# Altium schematic sheet Motor Connection.SchDoc: Motor Connection
size A4; DocumentNumber: 12; SheetNumber: 12; SheetTotal: 51
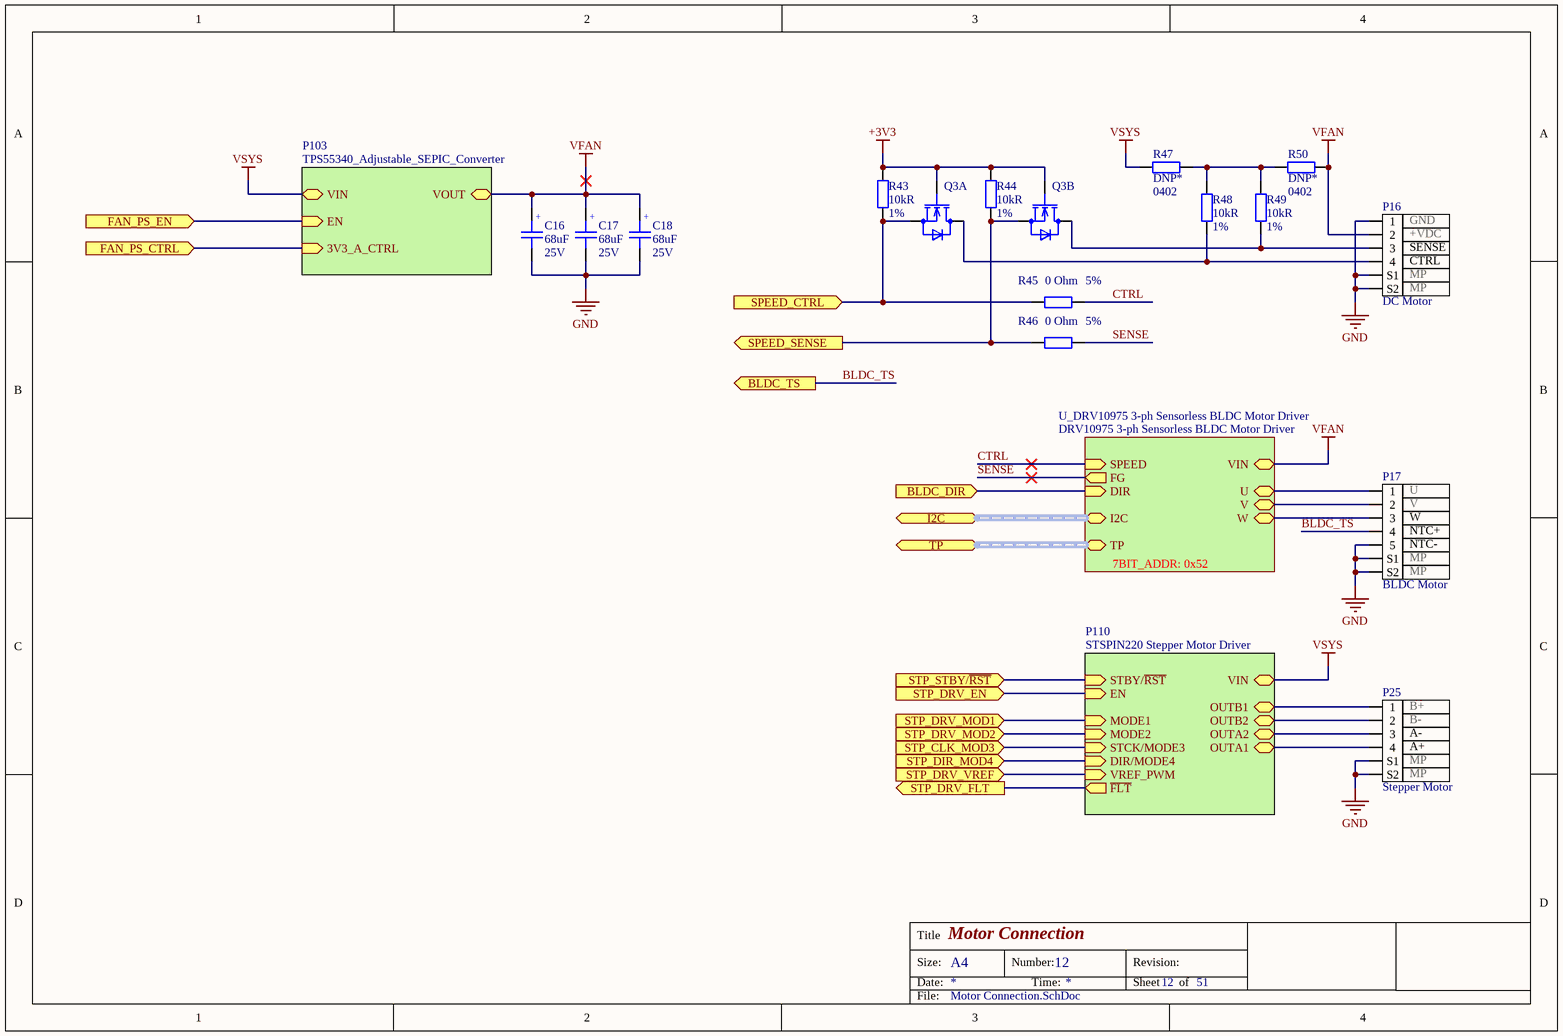
[diagram p0: Motor Connection.SchDoc]

## Parts
C16  Capacitance: 68uF  Rated Voltage: 25V  [WCAP-ASLI_6.3x5.5]  (hidden comment: CAP ALUM 68 UF 20% 25 V SMD)
C17  Capacitance: 68uF  Rated Voltage: 25V  [WCAP-ASLI_6.3x5.5]  (hidden comment: CAP ALUM 68 UF 20% 25 V SMD)
C18  Capacitance: 68uF  Rated Voltage: 25V  [WCAP-ASLI_6.3x5.5]  (hidden comment: CAP ALUM 68 UF 20% 25 V SMD)
P16  DC Motor  pin_1: GND  pin_2: +VDC  pin_MP1: MP  pin_3: SENSE  pin_4: CTRL  [CONN_JST_S4B-ZR-SM4A-TF(LF)(SN)]
P17  BLDC Motor  pin_1: U  pin_2: V  pin_MP1: MP  pin_3: W  pin_4: NTC+  pin_5: NTC-  [CONN_JST_S5B-ZR-SM4A-TF(LF)(SN)]
P25  Stepper Motor  pin_1: B+  pin_2: B-  pin_MP1: MP  pin_3: A-  pin_4: A+  [CONN_JST_SM4B-NSHSS-TB(LF)(SN)]
Q3  DMN32D2LV-7  [SON_400UV-7_DIO]  (value not drawn)  (parts A,B of 2)
R43  Resistance: 10kR  Tolerance: 1%  [R0402]  (hidden comment: RES SMD 10K OHM 1% 1/16W 0402)
R44  Resistance: 10kR  Tolerance: 1%  [R0402]  (hidden comment: RES SMD 10K OHM 1% 1/16W 0402)
R45  Tolerance: 5%  Resistance: 0 Ohm  [R0402]  (hidden comment: RES SMD 0 OHM JUMPER 1/16W 0402)
R46  Tolerance: 5%  Resistance: 0 Ohm  [R0402]  (hidden comment: RES SMD 0 OHM JUMPER 1/16W 0402)
R47  DNP*  Case/Package: 0402  [R0402]  (no BOM)
R48  Resistance: 10kR  Tolerance: 1%  [R0402]  (hidden comment: RES SMD 10K OHM 1% 1/16W 0402)
R49  Resistance: 10kR  Tolerance: 1%  [R0402]  (hidden comment: RES SMD 10K OHM 1% 1/16W 0402)
R50  DNP*  Case/Package: 0402  [R0402]  (no BOM)

## Sub-sheets
P103 = TPS55340_Adjustable_SEPIC_Converter: EN (in), VIN, VOUT, 3V3_A_CTRL (in)
P110 = STSPIN220 Stepper Motor Driver: MODE1 (in), OUTB1, VREF_PWM (in), EN (in), MODE2 (in), OUTB2, OUTA2, DIR/MODE4 (in), STCK/MODE3 (in), ~{FLT} (out), STBY/~{RST} (in), OUTA1, VIN
U_DRV10975 3-ph Sensorless BLDC Motor Driver = DRV10975 3-ph Sensorless BLDC Motor Driver: U, V, W, VIN, SPEED (in), DIR (in), FG (out), I2C (harness I2C), TP (harness DRV10975_TP)  | 7BIT_ADDR: 0x52

## Ports
BLDC_DIR (in), BLDC_TS (out), FAN_PS_CTRL (in), FAN_PS_EN (in), I2C (harness I2C), SPEED_CTRL (in), SPEED_SENSE (out), STP_CLK_MOD3 (in), STP_DIR_MOD4 (in), STP_DRV_EN (in), STP_DRV_FLT (out), STP_DRV_MOD1 (in), STP_DRV_MOD2 (in), STP_DRV_VREF (in), STP_STBY/~{RST} (in), TP (harness DRV10975_TP)

## Nets
+3V3: Q3.2(G) Q3.5(G) R43.1 R44.1
GND: C16.2 C17.2 C18.2 P16.1 P16.S1 P16.S2 P17.5 P17.S1 P17.S2 P25.S1 P25.S2
VFAN: C16.1 C17.1 C18.1 P16.2 R50.2 ; sheet P103/VOUT, sheet U_DRV10975 3-ph Sensorless BLDC Motor Driver/VIN
VSYS: R47.1 ; sheet P110/VIN, sheet P103/VIN
BLDC_DIR: port BLDC_DIR, sheet U_DRV10975 3-ph Sensorless BLDC Motor Driver/DIR
BLDC_TS: P17.4 ; port BLDC_TS
CTRL: R45.2 ; sheet U_DRV10975 3-ph Sensorless BLDC Motor Driver/SPEED
FAN_PS_CTRL: port FAN_PS_CTRL, sheet P103/3V3_A_CTRL
FAN_PS_EN: port FAN_PS_EN, sheet P103/EN
SENSE: R46.2 ; sheet U_DRV10975 3-ph Sensorless BLDC Motor Driver/FG
SPEED_CTRL: Q3.1(S) R43.2 R45.1 ; port SPEED_CTRL
SPEED_SENSE: Q3.4(S) R44.2 R46.1 ; port SPEED_SENSE
STP_CLK_MOD3: port STP_CLK_MOD3, sheet P110/STCK/MODE3
STP_DIR_MOD4: port STP_DIR_MOD4, sheet P110/DIR/MODE4
STP_DRV_EN: port STP_DRV_EN, sheet P110/EN
STP_DRV_FLT: port STP_DRV_FLT, sheet P110/~{FLT}
STP_DRV_MOD1: port STP_DRV_MOD1, sheet P110/MODE1
STP_DRV_MOD2: port STP_DRV_MOD2, sheet P110/MODE2
STP_DRV_VREF: port STP_DRV_VREF, sheet P110/VREF_PWM
STP_STBY/~{RST}: port STP_STBY/~{RST}, sheet P110/STBY/~{RST}
NetP16_3: P16.3 Q3.3(D) R49.2
NetP16_4: P16.4 Q3.6(D) R48.2
NetP17_1: P17.1 ; sheet U_DRV10975 3-ph Sensorless BLDC Motor Driver/U
NetP17_2: P17.2 ; sheet U_DRV10975 3-ph Sensorless BLDC Motor Driver/V
NetP17_3: P17.3 ; sheet U_DRV10975 3-ph Sensorless BLDC Motor Driver/W
NetP25_1: P25.1 ; sheet P110/OUTB1
NetP25_2: P25.2 ; sheet P110/OUTB2
NetP25_3: P25.3 ; sheet P110/OUTA2
NetP25_4: P25.4 ; sheet P110/OUTA1
NetR47_2: R47.2 R48.1 R49.1 R50.1

## Buses and harness runs
harness port I2C = sheet U_DRV10975 3-ph Sensorless BLDC Motor Driver/I2C
harness port TP = sheet U_DRV10975 3-ph Sensorless BLDC Motor Driver/TP

## Notes on the sheet
- Title
- Size:
- Date:
- A4
- Number:
- Time:
- Revision:
- Sheet
- of
- File:
- (in symbol CAP ALUM 68 UF 20% 25 V SMD) +

## Library data of the parts
C16-C18 = CAP ALUM 68 UF 20% 25 V SMD: 68µF 25V Aluminum Electrolytic Capacitors Radial, Can - SMD  2000 Hrs @ 105°C; Manufacturer: Wurth Elektronik; Manufacturer Part Number: 865080443009; Dissipation Factor: 14%; Endurance: 2000h; Leakage Current: 17uA; Ripple Current: 240mA; Capacitance Tolerance: +/-20%; Technical Reference: ASED055680M025DVCTBB000; Supplier 1: Digi-Key; Packaging: Tape and Reel; ComponentLink1URL: http://www.we-online.de; ComponentLink1Description: Manufacturer; Supplier Part Number 1: 732-8437-1-ND; Diameter: 6.3mm; Height: 5.5mm; ComponentLink2URL: https://www.we-online.com/catalog/datasheet/865080443009.pdf; ComponentLink2Description: Datasheet; Mounting Technology: SMT; Operating Temperature: -55 to +105degC; Published Date: May 2020; Mount: Surface Mount
P16 = CONN HEADER SMD R/A 4POS 1.5MM: Connector Header Surface Mount, Right Angle 4 position 0.059" (1.50mm); Manufacturer: JST; Manufacturer Part Number: S4B-ZR-SM4A-TF(LF)(SN); Number of Positions: 4; Connector Type: Male Pin; Contact Resistance: 30mR; Max Current Rating: 1A; Voltage Rating: 50V; Gender: Male; Pitch: 1.5mm; Supplier 1: Digi-Key; Stock 1: 0; Mount: Surface Mount; Color: Natural; Contact Plating: Tin,Copper; Contact Material: Brass,Tin; Housing Color: Beige; Housing Material: Polyamide; Min Operating Temperature: -25°C; Max Operating Temperature: 85°C; Number of Rows: 1; Packaging: Tape and Reel; Series: ZH; Contact Type: Male Pin; Termination: Solder; Current Rating: 1A; Fastening Type: Detent; Max Voltage Rating (AC): 50V; Max Voltage Rating (DC): 50V; Number of Contacts: 4; Orientation: Right Angle; Length: 9mm; Width: 3.5mm; Height: 7.2mm; Depth: 6.5mm; Lead Free: Lead Free; ComponentLink1URL: http://www.jst-mfg.com/product/pdf/eng/eZH.pdf?src-supplier=Digi-Key; ComponentLink1Description: http://www.jst-mfg.com/product/pdf/eng/eZH.pdf?src-supplier=Digi-Key; ComponentLink2URL: http://uk.rs-online.com/webdocs/13ed/0900766b813ed0da.pdf?src-supplier=RSComponents; ComponentLink2Description: http://uk.rs-online.com/webdocs/13ed/0900766b813ed0da.pdf?src-supplier=RSComponents; ComponentLink3URL: https://www.verical.com/server-webapp/html/getDatasheet?partID=646289&src-supplier=Verical; ComponentLink3Description: https://www.verical.com/server-webapp/html/getDatasheet?partID=646289&src-supplier=Verical; ComponentLink4URL: https://www.verical.com/server-webapp/html/getDatasheet?partID=558977&src-supplier=Verical; ComponentLink4Description: https://www.verical.com/server-webapp/html/getDatasheet?partID=558977&src-supplier=Verical; Supplier Part Number 1: 455-1695-1-ND; pin_MP2: MP
P17 = CONN HEADER SMD R/A 5POS 1.5MM: Connector Header Surface Mount, Right Angle 5 position 0.059" (1.50mm); Manufacturer: JST; Manufacturer Part Number: S5B-ZR-SM4A-TF(LF)(SN); Number of Positions: 5; Connector Type: Male Pin; Contact Resistance: 30mR; Current Rating: 1A; Voltage Rating: 50V; Gender: Male; Pitch: 1.5mm; Supplier 1: Digi-Key; Stock 1: 0; Mount: Surface Mount; Color: Natural; Contact Plating: Tin,Copper; Contact Material: Brass,Tin; Housing Material: Polyamide; Housing Color: Beige; Min Operating Temperature: -25°C; Max Operating Temperature: 85°C; Number of Rows: 1; Packaging: Tape and Reel; Series: ZH; Contact Type: Male Pin; Termination: Solder; Max Current Rating: 1A; Fastening Type: Detent; Max Voltage Rating (AC): 50V; Number of Contacts: 5; Orientation: Right Angle; Length: 10.5mm; Width: 3.5mm; Height: 7.2mm; Depth: 6.5mm; REACH SVHC: Unknown; Lead Free: Lead Free; ComponentLink1URL: http://www.farnell.com/datasheets/2322661.pdf?src-supplier=Element14; ComponentLink1Description: http://www.farnell.com/datasheets/2322661.pdf?src-supplier=Element14; ComponentLink2URL: http://www.jst-mfg.com/product/pdf/eng/eZH.pdf?src-supplier=Digi-Key; ComponentLink2Description: http://www.jst-mfg.com/product/pdf/eng/eZH.pdf?src-supplier=Digi-Key; ComponentLink3URL: https://www.verical.com/server-webapp/html/getDatasheet?partID=640788&src-supplier=Verical; ComponentLink3Description: https://www.verical.com/server-webapp/html/getDatasheet?partID=640788&src-supplier=Verical; ComponentLink4URL: http://www.jst-mfg.com/product/pdf/eng/eZR.pdf?src-supplier=Future+Electronics; ComponentLink4Description: http://www.jst-mfg.com/product/pdf/eng/eZR.pdf?src-supplier=Future+Electronics; Supplier Part Number 1: 455-1696-1-ND; pin_MP2: MP
P25 = CONN HEADER SMD R/A 4POS 1MM: Connector Header Surface Mount, Right Angle 4 position 0.039" (1.00mm); Manufacturer: JST; Manufacturer Part Number: SM04B-NSHSS-TB(LF)(SN); Number of Positions: 4; Connector Type: Outer Shroud Contact; Pitch: 0.039inch; Supplier 1: Digi-Key; Stock 1: 27326; Pricing 1: 1=0.79, 10=0.694, 100=0.5985, 500=0.4897 (USD); Mount: Surface Mount; Color: Natural; Contact Plating: Tin; Fastening Type: Latch; Packaging: Tape and Reel; Number of Rows: 1; Termination: Solder; Series: NSH; Contact Type: Outer Shroud Contact; Supplier Part Number 1: 455-2774-1-ND; pin_MP2: MP
Q3 = ARRAY MOSFET 2N-CH 30V 0.4A SOT-563: Mosfet Array 2 N-Channel (Dual) 30V 400mA 400mW Surface Mount SOT-563; Manufacturer: Diodes; Gate to Source Voltage (Vgs): 10V; Rds On Max: 1.2R; Input Capacitance: 39pF; Number of Channels: 2; Supplier 1: Digi-Key; Manufacturer Part Number: DMN32D2LV-7; Stock 1: 141366; Pricing 1: 1=0.39, 10=0.338, 25=0.3152, 100=0.234, 500=0.1827, 1000=0.1485 (USD); Mount: Surface Mount; Min Operating Temperature: -55°C; Max Operating Temperature: 150°C; Continuous Drain Current (ID): 400mA; Package Quantity: 3000; Packaging: Tape and Reel; Drain to Source Voltage (Vdss): 30V; Max Power Dissipation: 400mW; Drain to Source Breakdown Voltage: 30V; Drain to Source Resistance: 1.2R; Element Configuration: Dual; FET Type: 2 N-Channel; Length: 1.6mm; Height: 0.6mm; Width: 1.2mm; Radiation Hardening: No; REACH SVHC: No SVHC; ComponentLink1URL: https://www.diodes.com/assets/Datasheets/ds31121.pdf?src-supplier=Digi-Key; ComponentLink1Description: https://www.diodes.com/assets/Datasheets/ds31121.pdf?src-supplier=Digi-Key; ComponentLink2URL: http://www.mouser.com/ds/2/115/ds31121-89496.pdf?src-supplier=Mouser; ComponentLink2Description: http://www.mouser.com/ds/2/115/ds31121-89496.pdf?src-supplier=Mouser; ComponentLink3URL: http://www.diodes.com///datasheets/ds31121.pdf?src-supplier=Avnet; ComponentLink3Description: http://www.diodes.com///datasheets/ds31121.pdf?src-supplier=Avnet; Supplier Part Number 1: DMN32D2LV-7DICT-ND; Case/Package: SOT-563; Weight: 0.000106oz; Polarity: N-CHANNEL; Series: -
R43 R44 R48 R49 = RES SMD 10K OHM 1% 1/16W 0402: 10 kOhms ±1% 0.063W, 1/16W Chip Resistor 0402 (1005 Metric) Moisture Resistant Thick Film; Manufacturer Part Number: RC0402FR-0710KP; Manufacturer: Yageo; Temperature Coefficient: 150ppm/°C; Max Power Dissipation: 63mW; Supplier 1: Digi-Key; Stock 1: 839368; Pricing 1: 1=0.1, 10=0.035, 100=0.014, 1000=0.0063, 2500=0.0055, 5000=0.0045 (USD); Case Code (Imperial): 0402; Case Code (Metric): 1005; Min Operating Temperature: -55°C; Max Operating Temperature: 155°C; Composition: Thick Film; Packaging: Tape and Reel; Number of Terminations: 2; Length: 0.039inch; Height: 0.016inch; Width: 0.02inch; ComponentLink1URL: http://www.yageo.com/NewPortal/yageodocoutput?fileName=/pdf/R-Chip/PYu-RC_51_RoHS_P_0.pdf&src-supplier=Digi-Key; ComponentLink1Description: http://www.yageo.com/NewPortal/yageodocoutput?fileName=/pdf/R-Chip/PYu-RC_51_RoHS_P_0.pdf&src-supplier=Digi-Key; Supplier Part Number 1: YAG1249CT-ND; Case/Package: 0402; Features: Moisture Resistant; Mount: Surface Mount
R45 R46 = RES SMD 0 OHM JUMPER 1/16W 0402: 0 Ohms Jumper 0.063W, 1/16W Chip Resistor 0402 (1005 Metric) Moisture Resistant Thick Film; Manufacturer: Yageo; Manufacturer Part Number: RC0402JR-070RL; Power Rating: 62.5mW; Voltage Rating: 50V; Max Power Dissipation: 63mW; Temperature Coefficient: 200ppm/°C; Supplier 1: Digi-Key; Stock 1: 46057148; Pricing 1: 1=0.1, 10=0.013, 25=0.0092, 50=0.0072, 100=0.0053, 250=0.004, 500=0.0032, 1000=0.0024, 5000=0.0017 (USD); Contact Plating: Tin,Matte; Case Code (Metric): 1005; Case Code (Imperial): 0402; Min Operating Temperature: -55°C; Max Operating Temperature: 155°C; Packaging: Tape and Reel; Composition: Thick Film; Package Quantity: 1; Number of Terminations: 2; Termination: SMD/SMT; Military Standard: Not; Features: Moisture Resistant; Length: 1mm; Height: 0.016inch; Width: 0.02inch; Depth: 0.5mm; Radiation Hardening: No; REACH SVHC: Unknown; Lead Free: Lead Free; ComponentLink1URL: http://www.yageo.com/documents/recent/PYu-RC_Group_51_RoHS_L_10.pdf?src-supplier=Digi-Key; ComponentLink1Description: http://www.yageo.com/documents/recent/PYu-RC_Group_51_RoHS_L_10.pdf?src-supplier=Digi-Key; ComponentLink2URL: http://www.yageo.com/documents/recent/PYu-RC0402_51_RoHS_L_6.pdf?src-supplier=Avnet+Europe; ComponentLink2Description: http://www.yageo.com/documents/recent/PYu-RC0402_51_RoHS_L_6.pdf?src-supplier=Avnet+Europe; ComponentLink3URL: http://www.farnell.com/datasheets/1018594.pdf?src-supplier=Element14; ComponentLink3Description: http://www.farnell.com/datasheets/1018594.pdf?src-supplier=Element14; ComponentLink4URL: https://www.verical.com/server-webapp/html/getDatasheet?partID=326379&src-supplier=Verical; ComponentLink4Description: https://www.verical.com/server-webapp/html/getDatasheet?partID=326379&src-supplier=Verical; ComponentLink5URL: http://www.farnell.com/datasheets/2167052.pdf?src-supplier=Element14; ComponentLink5Description: http://www.farnell.com/datasheets/2167052.pdf?src-supplier=Element14; Supplier Part Number 1: 311-0.0JRCT-ND; Case/Package: 0402; Mount: Surface Mount
R47 R50 = RES SMD NO BOM 0402: Placeholder for a 0402 resistor